# EAGLE schematic psoc1_20246_B (EAGLE 7.2.0)
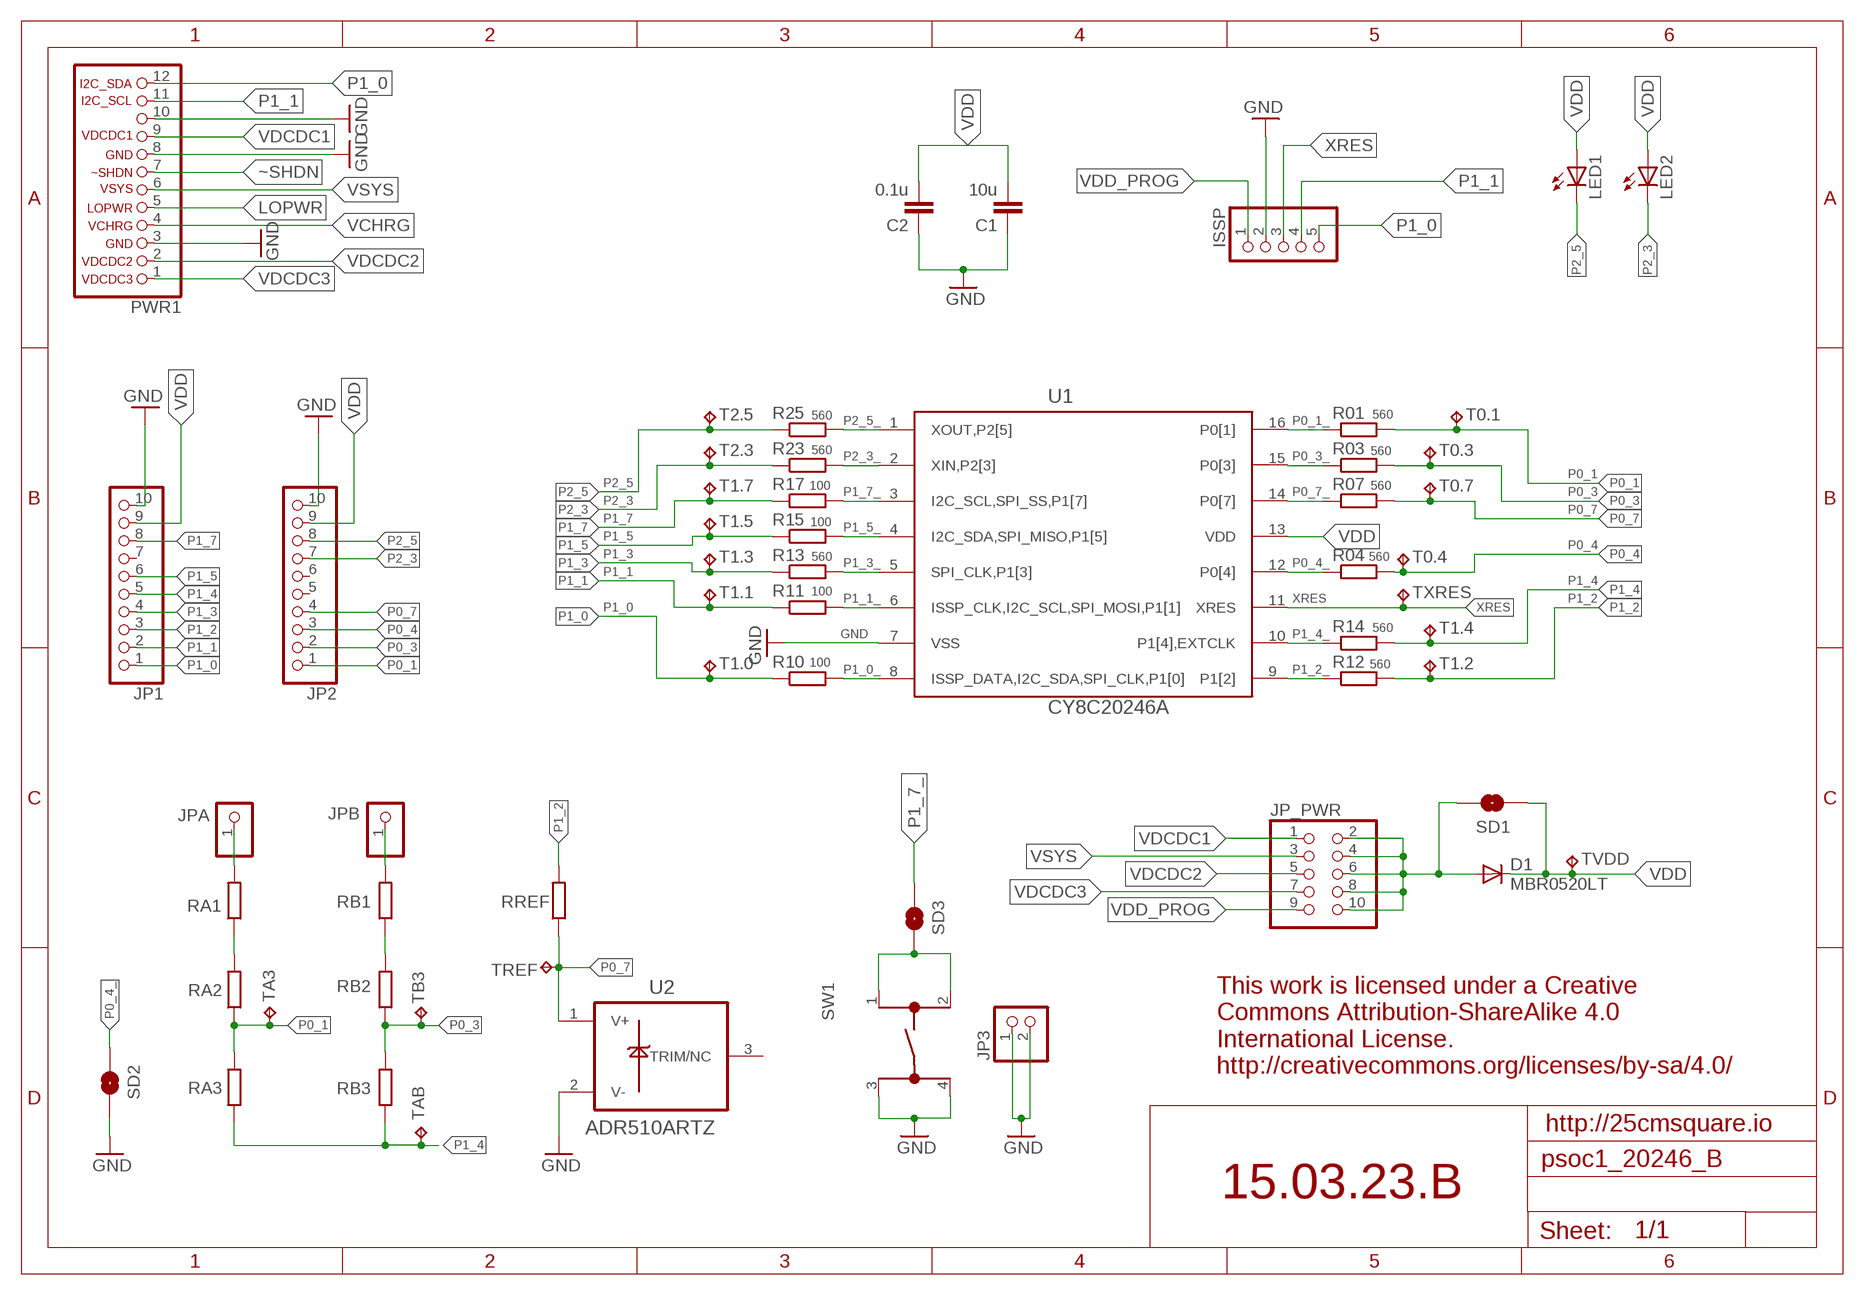
[diagram p0: schematic, sheet 1]

## Parts
C1  10u  C-EUC1206  [C1206]
C2  0.1u  C-EUC0603  [C0603]
D1  MBR0520LT  [SOD123]
ISSP  PINHD-1X5/90  [1X05/90]
JP1  PINHD-1X10  [1X10]
JP2  PINHD-1X10  [1X10]
JP3  PINHD-1X2  [1X02]
JP_PWR  PINHD-2X5  [2X05]
JPA  PINHD-1X1  [1X01]
JPB  PINHD-1X1  [1X01]
LED1  LEDSML0603  [SML0603]
LED2  LEDSML0603  [SML0603]
PWR1  LIWE_12_PIN_PWR  [LIWE_12_PIN]
R01  560  R-EU_R0603  [R0603]
R03  560  R-EU_R0603  [R0603]
R04  560  R-EU_R0603  [R0603]
R07  560  R-EU_R0603  [R0603]
R10  100  R-EU_R0603  [R0603]
R11  100  R-EU_R0603  [R0603]
R12  560  R-EU_R0603  [R0603]
R13  560  R-EU_R0603  [R0603]
R14  560  R-EU_R0603  [R0603]
R15  100  R-EU_R0603  [R0603]
R17  100  R-EU_R0603  [R0603]
R23  560  R-EU_R0603  [R0603]
R25  560  R-EU_R0603  [R0603]
RA1  R-EU_R0603  [R0603]
RA2  R-EU_R0603  [R0603]
RA3  R-EU_R0603  [R0603]
RB1  R-EU_R0603  [R0603]
RB2  R-EU_R0603  [R0603]
RB3  R-EU_R0603  [R0603]
RREF  R-EU_R0603  [R0603]
SD1  SOLDERJUMPERNO  [SJ_2S-NO]
SD2  SOLDERJUMPERNO  [SJ_2S-NO]
SD3  SOLDERJUMPERNO  [SJ_2S-NO]
SW1  FSM4JH  [FSM4JH]
T0.1  TPTP14R  [TP14R]
T0.3  TPTP14R  [TP14R]
T0.4  TPTP14R  [TP14R]
T0.7  TPTP14R  [TP14R]
T1.0  TPTP14R  [TP14R]
T1.1  TPTP14R  [TP14R]
T1.2  TPTP14R  [TP14R]
T1.3  TPTP14R  [TP14R]
T1.4  TPTP14R  [TP14R]
T1.5  TPTP14R  [TP14R]
T1.7  TPTP14R  [TP14R]
T2.3  TPTP14R  [TP14R]
T2.5  TPTP14R  [TP14R]
TA3  TPTP14R  [TP14R]
TAB  TPTP14R  [TP14R]
TB3  TPTP14R  [TP14R]
TREF  TPTP14R  [TP14R]
TVDD  TPTP14R  [TP14R]
TXRES  TPTP14R  [TP14R]
U1  CY8C20246A  [QFN16_3X3_NOEPAD]
U2  ADR510ARTZ  ADR510ARTZ-REEL7  [SOT95P237X112-3N]

## Nets
GND: C1.1 C2.1 ISSP.2 JP1.10 JP2.10 JP3.1 JP3.2 PWR1.3 PWR1.8 PWR1.10 SD2.2 SW1.3 SW1.4 U1.7(VSS) U2.2(V-)
LOPWR: PWR1.5
N$2: SD3.2 SW1.1 SW1.2
N$4: RB1.1 RB2.2
N$6: D1.A JP_PWR.2 JP_PWR.4 JP_PWR.6 JP_PWR.8 JP_PWR.10 SD1.2
N$24: JPB.1 RB1.2
N$29: RA1.1 RA2.2
N$30: JPA.1 RA1.2
P0_1: JP2.1 R01.2 RA2.1 RA3.2 T0.1.TP TA3.TP
P0_1_: R01.1 U1.16(P0[1])
P0_3: JP2.2 R03.2 RB2.1 RB3.2 T0.3.TP TB3.TP
P0_3_: R03.1 U1.15(P0[3])
P0_4: JP2.3 R04.2 T0.4.TP
P0_4_: R04.1 SD2.1 U1.12(P0[4])
P0_7: JP2.4 R07.2 RREF.1 T0.7.TP TREF.TP U2.1(V+)
P0_7_: R07.1 U1.14(P0[7])
P1_0: ISSP.5 JP1.1 PWR1.12 R10.1 T1.0.TP
P1_0_: R10.2 U1.8(ISSP_DATA,I2C_SDA,SPI_CLK,P1[0])
P1_1: ISSP.4 JP1.2 PWR1.11 R11.1 T1.1.TP
P1_1_: R11.2 U1.6(ISSP_CLK,I2C_SCL,SPI_MOSI,P1[1])
P1_2: JP1.3 R12.2 RREF.2 T1.2.TP
P1_2_: R12.1 U1.9(P1[2])
P1_3: JP1.4 R13.1 T1.3.TP
P1_3_: R13.2 U1.5(SPI_CLK,P1[3])
P1_4: JP1.5 R14.2 RA3.1 RB3.1 T1.4.TP TAB.TP
P1_4_: R14.1 U1.10(P1[4],EXTCLK)
P1_5: JP1.6 R15.1 T1.5.TP
P1_5_: R15.2 U1.4(I2C_SDA,SPI_MISO,P1[5])
P1_7: JP1.8 R17.1 T1.7.TP
P1_7_: R17.2 SD3.1 U1.3(I2C_SCL,SPI_SS,P1[7])
P2_3: JP2.7 LED2.C R23.1 T2.3.TP
P2_3_: R23.2 U1.2(XIN,P2[3])
P2_5: JP2.8 LED1.C R25.1 T2.5.TP
P2_5_: R25.2 U1.1(XOUT,P2[5])
VCHRG: PWR1.4
VDCDC1: JP_PWR.1 PWR1.9
VDCDC2: JP_PWR.5 PWR1.2
VDCDC3: JP_PWR.7 PWR1.1
VDD: C1.2 C2.2 D1.C JP1.9 JP2.9 LED1.A LED2.A SD1.1 TVDD.TP U1.13(VDD)
VDD_PROG: ISSP.1 JP_PWR.9
VSYS: JP_PWR.3 PWR1.6
XRES: ISSP.3 TXRES.TP U1.11(XRES)
~SHDN: PWR1.7
Unconnected: JP1.7 JP2.5 JP2.6 U2.3(TRIM/NC)

## Notes on the sheet
- This work is licensed under a Creative
  Commons Attribution-ShareAlike 4.0
  International License.
  http://creativecommons.org/licenses/by-sa/4.0/
- http://25cmsquare.io
- 15.03.23.B

## Library data of the parts
C1 = rcl:C-EU: CAPACITOR, European symbol
C2 = resistor:C-EU: CAPACITOR, European symbol; SPICEPREFIX: C
D1 = diode:MBR0520LT: SCHOTTKY BARRIER RECTIFIER Source: http://onsemi.com .. MBR0520LT1-D.pdf
ISSP = pinhead:PINHD-1X5: PIN HEADER
JP1 JP2 = pinhead:PINHD-1X10: PIN HEADER
JP3 = pinhead:PINHD-1X2: PIN HEADER
JP_PWR = pinhead:PINHD-2X5: PIN HEADER
JPA JPB = pinhead:PINHD-1X1: PIN HEADER
LED1 LED2 = led:LED: LED OSRAM: - CHIPLED LG R971, LG N971, LY N971, LG Q971, LY Q971, LO R971, LY R971 LH N974, LH R974 LS Q976, LO Q976, LY Q976 LO Q996 - Hyper CHIPLED LW Q18S LB Q993, LB Q99A, LB R99A - SideLED LS A670, LO A670, LY A670, LG A670, LP A670 LB A673, LV A673, LT A673, LW A673 LH A674 LY A675 LS A676, LA A676, LO A676, LY A676, LW A676 LS A679, LY A679, LG A679 - Hyper Micro SIDELED® LS Y876, LA Y876, LO Y876, LY Y876 LT Y87S - SmartLED LW L88C, LW L88S LB L89C, LB L89S, LG L890 LS L89K, LO L89K, LY L89K LS L896, LA L896, LO L896, LY L896 - TOPLED LS T670, LO T670, LY T670, LG T670, LP T670 LSG T670, LSP T670, LSY T670, LOP T670, LYG T670 LG T671, LOG T671, LSG T671 LB T673, LV T673, LT T673, LW T673 LH T674 LS T676, LA T676, LO T676, LY T676, LB T676, LH T676, LSB T676, LW T676 LB T67C, LV T67C, LT T67C, LS T67K, LO T67K, LY T67K, LW E67C LS E67B, LA E67B, LO E67B, LY E67B, LB E67C, LV E67C, LT E67C LW T67C LS T679, LY T679, LG T679 LS T770, LO T770, LY T770, LG T770, LP T770 LB T773, LV T773, LT T773, LW T773 LH T774 LS E675, LA E675, LY E675, LS T675 LS T776, LA T776, LO T776, LY T776, LB T776 LHGB T686 LT T68C, LB T68C - Hyper Mini TOPLED® LB M676 - Mini TOPLED Santana® LG M470 LS M47K, LO M47K, LY M47K Source: http://www.osram.convergy.de LUXEON: - LUMILED® LXK2-PW12-R00, LXK2-PW12-S00, LXK2-PW14-U00, LXK2-PW14-V00 LXK2-PM12-R00, LXK2-PM12-S00, LXK2-PM14-U00 LXK2-PE12-Q00, LXK2-PE12-R00, LXK2-PE12-S00, LXK2-PE14-T00, LXK2-PE14-U00 LXK2-PB12-K00, LXK2-PB12-L00, LXK2-PB12-M00, LXK2-PB14-N00, LXK2-PB14-P00, LXK2-PB14-Q00 LXK2-PR12-L00, LXK2-PR12-M00, LXK2-PR14-Q00, LXK2-PR14-R00 LXK2-PD12-Q00, LXK2-PD12-R00, LXK2-PD12-S00 LXK2-PH12-R00, LXK2-PH12-S00 LXK2-PL12-P00, LXK2-PL12-Q00, LXK2-PL12-R00 Source: www.luxeon.com KINGBRIGHT: KA-3528ASYC Source: www.kingbright.com
PWR1 = pma:LIWE_12_PIN_PWR
R01 R03 R04 R07 R10-R15 R17 R23 R25 RA1-RA3 RB1-RB3 RREF = resistor:R-EU_: RESISTOR, European symbol; SPICEPREFIX: R
SD1-SD3 = SparkFun-Passives:SOLDERJUMPER: Solder Jumper Standard SMD solder jumper. Used to automate production. Two varients : Normally Open and Normally Closed are the same, but have different paste layers. NC will have a large amount of paste and should jumper during reflow.
SW1 = pma:FSM4JH: FSM4JH TE CONNECTIVITY / ALCOSWITCH http://sk.farnell.com/te-connectivity-alcoswitch/fsm4jh/switch-spno-0-05a/dp/1555982
T0.1 T0.3 T0.4 T0.7 T1.0 T1.1-T1.5 T1.7 T2.3 T2.5 TA3 TAB TB3 TREF TVDD TXRES = testpad:TP: Test pad
U1 = pma:CY8C20246A: CY8C20246A 1.8 V Programmable CapSense® Controller with SmartSense™ Auto-tuning 1–33 Buttons, 0–6 Sliders http://www.cypress.com/?docID=46872
U2 = Analog Devices_By_element14_Batch_1:ADR510ARTZ-REEL7: 1.0 V Precision Low Noise Shunt Voltage Reference; MPN: ADR510ARTZ-REEL7; OC_FARNELL: -; OC_NEWARK: 19M8736; PACKAGE: SOT-23-3; SUPPLIER: Analog Devices